# Altium schematic sheet microSD_reader.SchDoc
size A; SheetNumber: 2; SheetTotal: 4
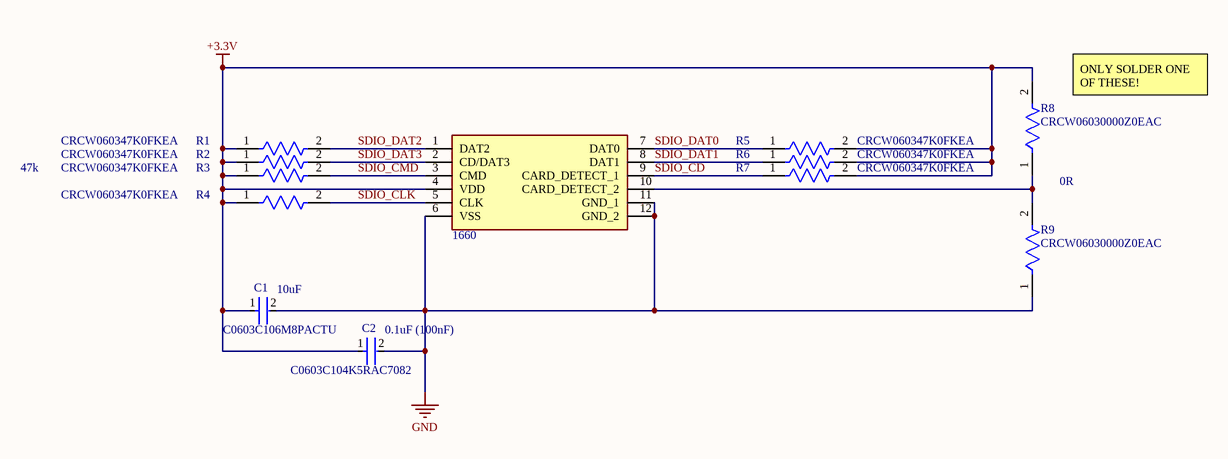
[diagram p0: microSD_reader.SchDoc]

## Parts
C1  C0603C106M8PACTU  [FP-C0603C106M8PACTU-MFG]
C2  C0603C104K5RAC7082  [FP-C0603C-CF-MFG]
J1  1660  [1660]
R1  CRCW060347K0FKEA  [FP-CRCW0603-e3-IPC_B]
R2  CRCW060347K0FKEA  [FP-CRCW0603-e3-IPC_B]
R3  CRCW060347K0FKEA  [FP-CRCW0603-e3-IPC_B]
R4  CRCW060347K0FKEA  [FP-CRCW0603-e3-IPC_B]
R5  CRCW060347K0FKEA  [FP-CRCW0603-e3-IPC_B]
R6  CRCW060347K0FKEA  [FP-CRCW0603-e3-IPC_B]
R7  CRCW060347K0FKEA  [FP-CRCW0603-e3-IPC_B]
R8  CRCW06030000Z0EAC  [FP-CRCW0603-C-IPC_B]
R9  CRCW06030000Z0EAC  [FP-CRCW0603-C-IPC_B]

## Nets
+3.3V: C1.1 C2.1 J1.4(VDD) R1.1 R2.1 R3.1 R4.1 R5.2 R6.2 R7.2 R8.2
GND: C1.2 C2.2 J1.6(VSS) J1.11(GND_1) J1.12(GND_2) R9.1
SDIO_CD: J1.9(CARD_DETECT_1) R7.1
SDIO_CLK: J1.5(CLK) R4.2
SDIO_CMD: J1.3(CMD) R3.2
SDIO_DAT0: J1.7(DAT0) R5.1
SDIO_DAT1: J1.8(DAT1) R6.1
SDIO_DAT2: J1.1(DAT2) R1.2
SDIO_DAT3: J1.2(CD/DAT3) R2.2
NetJ1_10: J1.10(CARD_DETECT_2) R8.1 R9.2

## Notes on the sheet
- (near R8) ONLY SOLDER ONE OF THESE!
- 47k
- 0R
- (near C1) 10uF
- (near C2) 0.1uF (100nF)

## Library data of the parts
C1 = CMP-03020-034654-1: CAP CER 10UF 10V X5R 0603; RoHS Compliant: Yes
C2 = CMP-03020-002411-2: C0603 0.10 μF X7R 30ppm/°C 10.00% 50 V; Manufacturer: KEMET; Voltage Rating: 50 V; Capacitance: 0.10 μF; Automotive Grade: Grade 1; Material: Ceramic; Value: 0.10 μF; Tolerance: 0.1; Automotive: Yes; Temperature Range Low: -55°C; Octopart: https://octopart.com/c0603c104k5rac7082-kemet-75146597; Temperature Coefficient: 30ppm/°C; ComponentLink2URL: https://api.kemet.com/component-edge/download/datasheet/C0603C100J5GACAUTO.pdf; RoHS: TRUE; ComponentLink2Description: Datasheet; Manufacturer Part Number: C0603C104K5RAC7082; Height: 0.87mm; Device Class L3: Ceramic Capacitors; Package: C0603C-CF; Temperature Characteristic: X7R; Device Class L2: Capacitors; Lead Free: Yes; Device Class L1: Passive Components; Temperature: -55°C to +125°C; Temperature Range High: +125°C; Category: Cap
J1 = 1660: Adafruit Accessories MIcroSD Socket; Geometry.Height: 1mm; Mouser Part Number: 485-1660; Mouser Price/Stock: https://www.mouser.co.uk/ProductDetail/Adafruit/1660?qs=GURawfaeGuCXDyGMVdt6Kw%3D%3D; Manufacturer_Name: Adafruit; Manufacturer_Part_Number: 1660; Datasheet Link: https://cdn-shop.adafruit.com/datasheets/15882.pdf
R1-R7 = CMP-2000-03379-3: RES SMD 47K OHM 1% 1/10W 0603; Voltage Rating: 75V; Max Power Dissipation: 100mW; Resistance: 47kR; Temperature Coefficient: 100ppm/°C; Size Code: 0603; Technology: THICK FILM; Case Code (Metric): 1608; Radiation Hardening: No; Case/Package: 0603; Number of Terminations: 2; Package Quantity: 5000; Width: 0.85mm; Series: CRCW; RoHS Compliant: Yes; Case Code (Imperial): 0603; Lead Free: Lead Free; Resistance Tolerance: 1%; Depth: 0.85mm; Contact Plating: Tin; Tolerance: 1%; Voltage Rating (DC): 75V; Min Operating Temperature: -55°C; Mount: Surface Mount; Packaging: Tape and Reel; Length: 1.55mm; Resistor Type: Thick Film; Features: Automotive AEC-Q200; Max Operating Temperature: 155°C; Weight: 7.1E-05oz; Construction: Rectangular; Height: 0.45mm; Military Standard: Not; Termination: SMD/SMT; Power Rating: 100mW
R8 R9 = CMP-02407-012292-2: RES 0 OHM JUMPER 1/10W 0603; Resistance: 22R; Power Rating: 100mW; Case/Package: Molded; Contact Plating: Tin; Resistor Type: Thick Film; Min Operating Temperature: -55°C; Termination: Wraparound; Max Operating Temperature: 155°C; Lead Free: Lead Free; Length: 1.55mm; RoHS Compliant: Yes; Mount: Surface Mount